# Altium schematic sheet ControlPoint.SchDoc
size 420 x 297 mm
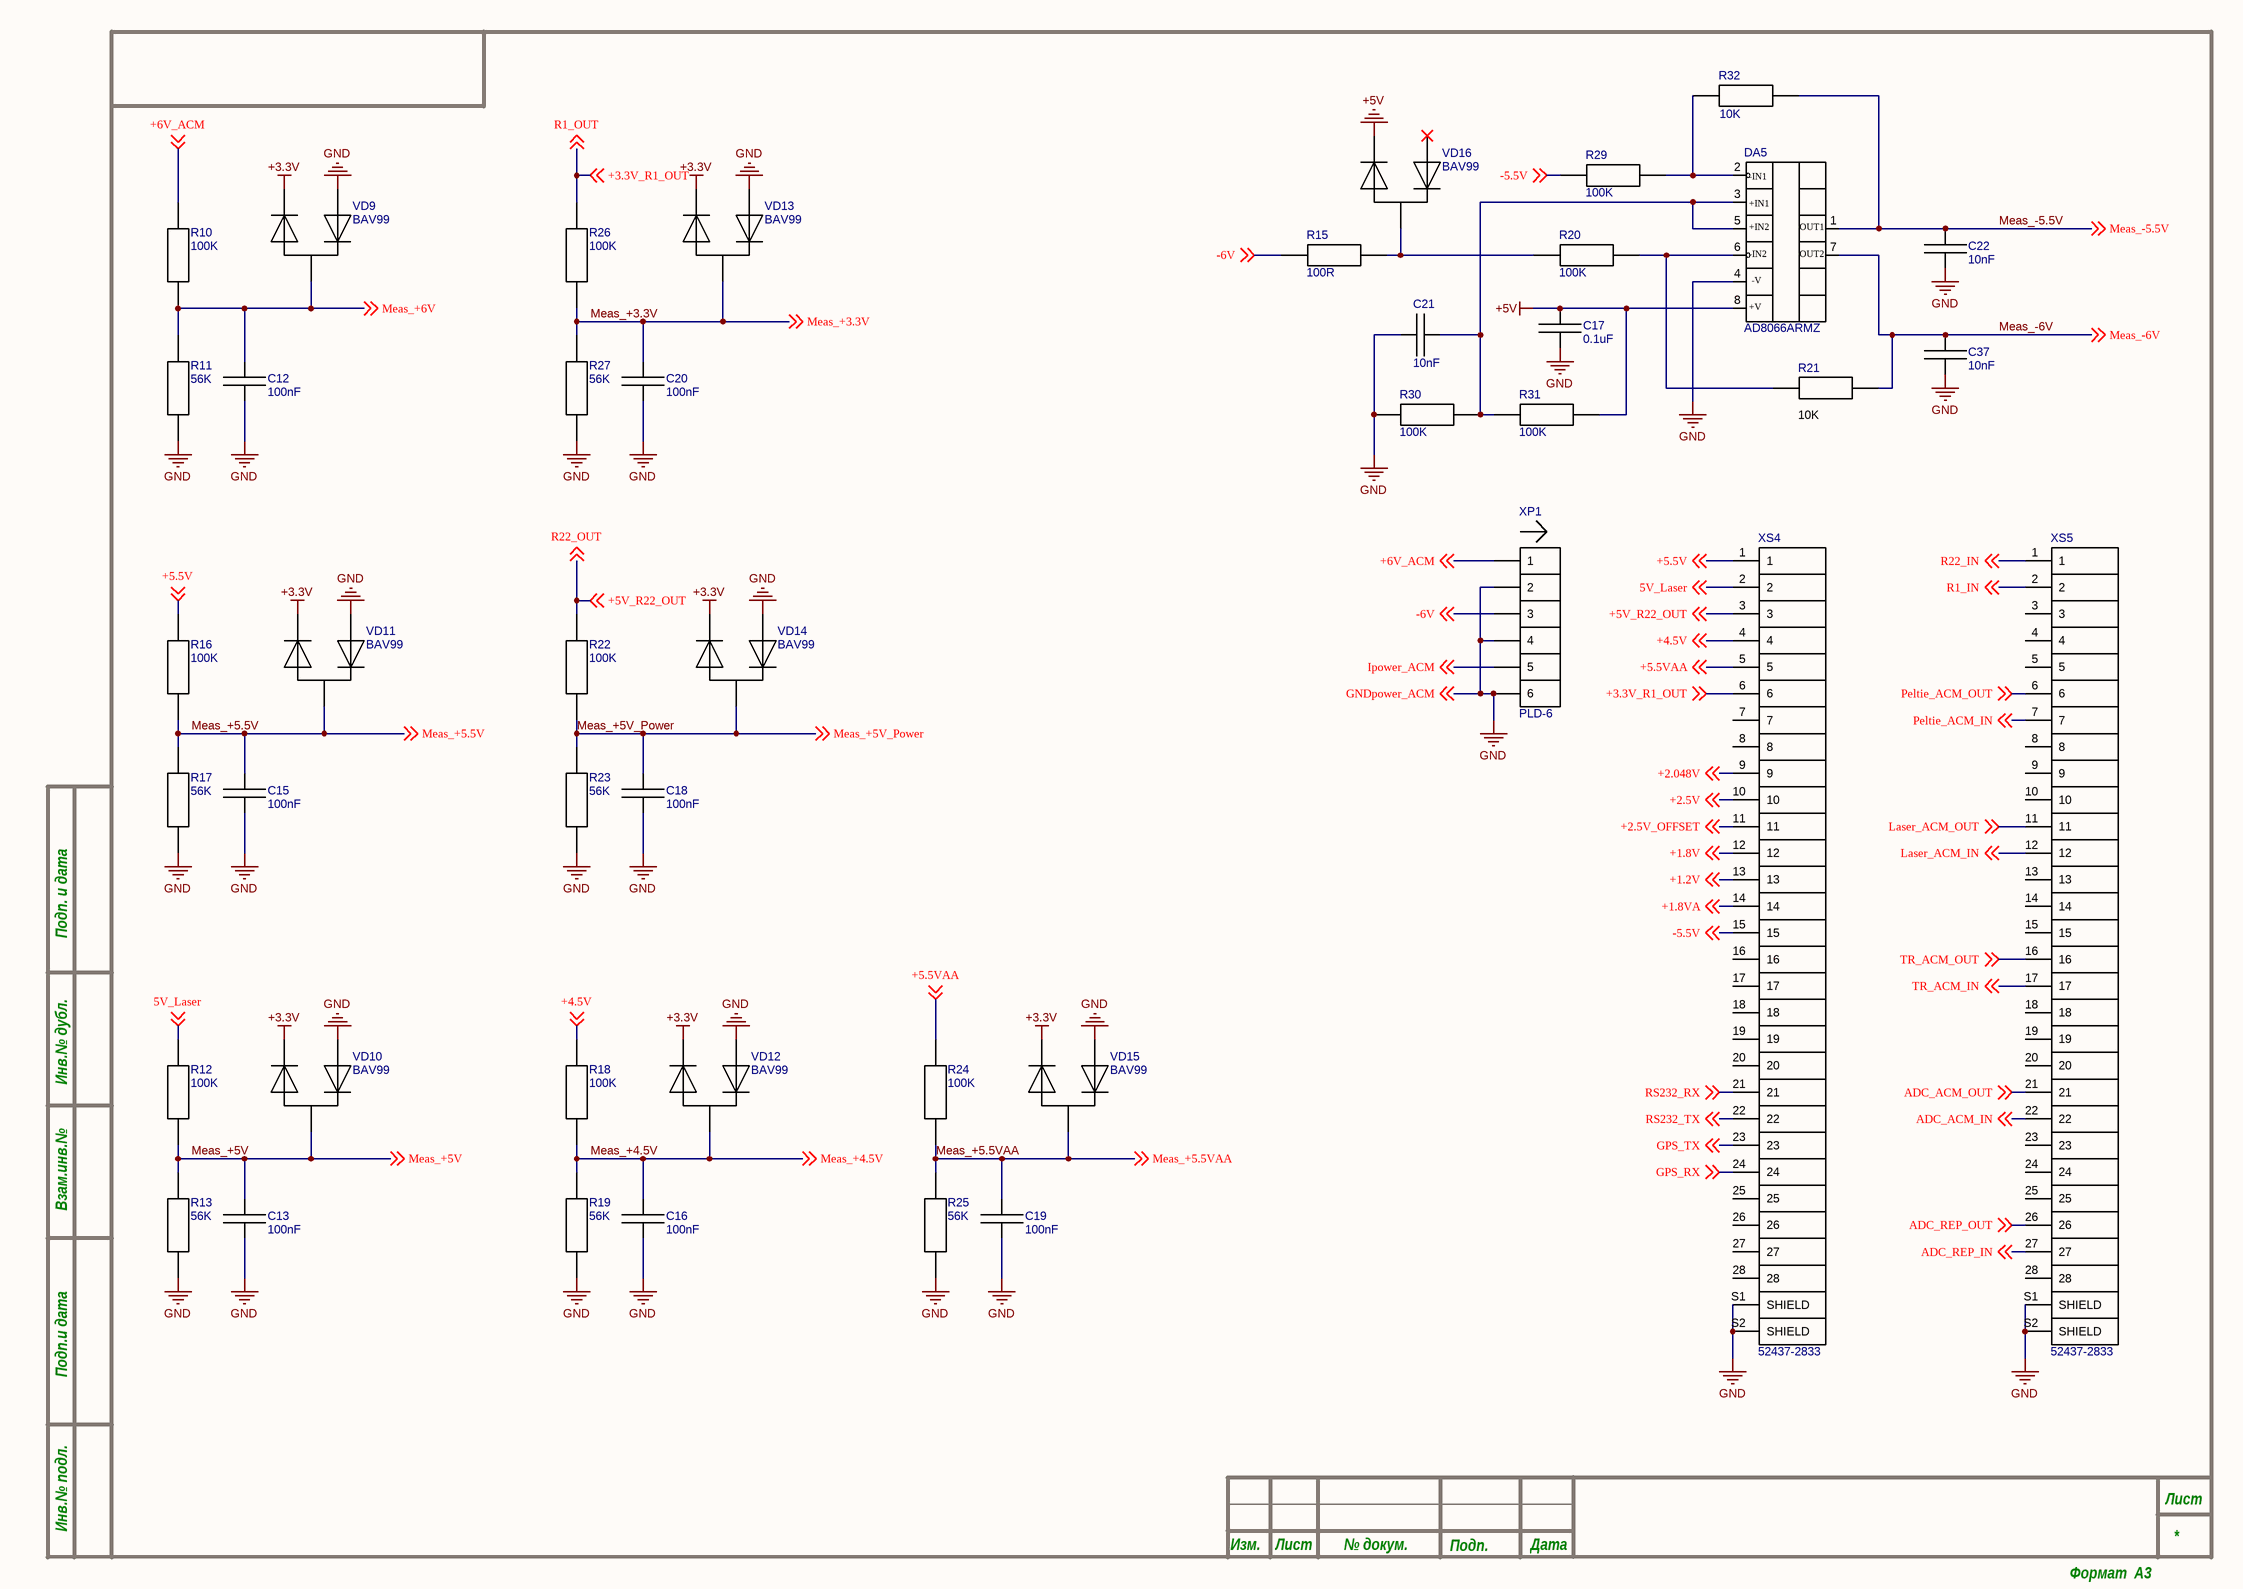
[diagram p0: ControlPoint.SchDoc]

## Parts
C12  100nF  [0402C]
C13  100nF  [0402C]
C15  100nF  [0402C]
C16  100nF  [0402C]
C17  0.1uF  [0603C]
C18  100nF  [0402C]
C19  100nF  [0402C]
C20  100nF  [0402C]
C21  10nF  [0402C]
C22  10nF  [0402C]
C37  10nF  [0402C]
DA5  AD8066ARMZ  [MSOP-8]
R10  100K  [R0402]
R11  56K  [R0402]
R12  100K  [R0402]
R13  56K  [R0402]
R15  100R  [R0402]
R16  100K  [R0402]
R17  56K  [R0402]
R18  100K  [R0402]
R19  56K  [R0402]
R20  100K  [R0402]
R21  10K  [R0402]
R22  100K  [R0402]
R23  56K  [R0402]
R24  100K  [R0402]
R25  56K  [R0402]
R26  100K  [R0402]
R27  56K  [R0402]
R29  100K  [R0402]
R30  100K  [R0402]
R31  100K  [R0402]
R32  10K  [R0402]
VD9  BAV99  [SOT-23-3]
VD10  BAV99  [SOT-23-3]
VD11  BAV99  [SOT-23-3]
VD12  BAV99  [SOT-23-3]
VD13  BAV99  [SOT-23-3]
VD14  BAV99  [SOT-23-3]
VD15  BAV99  [SOT-23-3]
VD16  BAV99  [SOT-23-3]
XP1  PLD-6  [PLD-6]
XS4  52437-2833  [MOLEX_52437-2833]
XS5  52437-2833  [MOLEX_52437-2833]

## Nets
+3.3V: VD9.2 VD10.2 VD11.2 VD12.2 VD13.2 VD14.2 VD15.2
+5V: C17.1 DA5.8(+VS) R31.2 VD16.2
GND: C12.1 C13.1 C15.1 C16.1 C17.2 C18.1 C19.1 C20.1 C21.1 C22.1 C37.1 DA5.4(-VS) R11.2 R13.2 R17.2 R19.2 R23.2 R25.2 R27.2 R30.1 VD9.1 VD10.1 VD11.1 VD12.1 VD13.1 VD14.1 VD15.1 XP1.2 XP1.4 XP1.6 XS4.S1(SHIELD) XS4.S2(SHIELD) XS5.S1(SHIELD) XS5.S2(SHIELD) ; off-sheet GNDpower_ACM  [also labelled GNDpower_ACM]
5V_Laser: R12.1 XS4.2 ; off-sheet 5V_Laser
+1.2V: XS4.13 ; off-sheet +1.2V
+1.8V: XS4.12 ; off-sheet +1.8V
+1.8VA: XS4.14 ; off-sheet +1.8VA
+2.5V: XS4.10 ; off-sheet +2.5V
+2.5V_OFFSET: XS4.11 ; off-sheet +2.5V_OFFSET
+2.048V: XS4.9 ; off-sheet +2.048V
+3.3V_R1_OUT: R26.1 XS4.6 ; off-sheet R1_OUT, off-sheet +3.3V_R1_OUT  [also labelled R1_OUT]
+4.5V: R18.1 XS4.4 ; off-sheet +4.5V
+5.5V: R16.1 XS4.1 ; off-sheet +5.5V
+5.5VAA: R24.1 XS4.5 ; off-sheet +5.5VAA
+5V_R22_OUT: R22.1 XS4.3 ; off-sheet R22_OUT, off-sheet +5V_R22_OUT  [also labelled R22_OUT]
+6V_ACM: R10.1 XP1.1 ; off-sheet +6V_ACM
-5.5V: R29.1 XS4.15 ; off-sheet -5.5V
-6V: R15.1 XP1.3 ; off-sheet -6V
ADC_ACM_IN: XS5.22 ; off-sheet ADC_ACM_IN
ADC_ACM_OUT: XS5.21 ; off-sheet ADC_ACM_OUT
ADC_REP_IN: XS5.27 ; off-sheet ADC_REP_IN
ADC_REP_OUT: XS5.26 ; off-sheet ADC_REP_OUT
GPS_RX: XS4.24 ; off-sheet GPS_RX
GPS_TX: XS4.23 ; off-sheet GPS_TX
Ipower_ACM: XP1.5 ; off-sheet Ipower_ACM
Laser_ACM_IN: XS5.12 ; off-sheet Laser_ACM_IN
Laser_ACM_OUT: XS5.11 ; off-sheet Laser_ACM_OUT
Meas_+3.3V: C20.2 R26.2 R27.1 VD13.3 ; off-sheet Meas_+3.3V
Meas_+4.5V: C16.2 R18.2 R19.1 VD12.3 ; off-sheet Meas_+4.5V
Meas_+5.5V: C15.2 R16.2 R17.1 VD11.3 ; off-sheet Meas_+5.5V
Meas_+5.5VAA: C19.2 R24.2 R25.1 VD15.3 ; off-sheet Meas_+5.5VAA
Meas_+5V: C13.2 R12.2 R13.1 VD10.3 ; off-sheet Meas_+5V
Meas_+5V_Power: C18.2 R22.2 R23.1 VD14.3 ; off-sheet Meas_+5V_Power
Meas_+6V: C12.2 R10.2 R11.1 VD9.3 ; off-sheet Meas_+6V
Meas_-5.5V: C22.2 DA5.1(VOUT) R32.2 ; off-sheet Meas_-5.5V
Meas_-6V: C37.2 DA5.7(VOUT2) R21.2 ; off-sheet Meas_-6V
Peltie_ACM_IN: XS5.7 ; off-sheet Peltie_ACM_IN
Peltie_ACM_OUT: XS5.6 ; off-sheet Peltie_ACM_OUT
R1_IN: XS5.2 ; off-sheet R1_IN
R22_IN: XS5.1 ; off-sheet R22_IN
RS232_RX: XS4.21 ; off-sheet RS232_RX
RS232_TX: XS4.22 ; off-sheet RS232_TX
TR_ACM_IN: XS5.17 ; off-sheet TR_ACM_IN
TR_ACM_OUT: XS5.16 ; off-sheet TR_ACM_OUT
NetC21_2: C21.2 DA5.3(+IN1) DA5.5(+IN2) R30.2 R31.1
NetDA5_2: DA5.2(-IN1) R29.2 R32.1
NetDA5_6: DA5.6(-IN2) R20.2 R21.1
NetR15_2: R15.2 R20.1 VD16.3

Not connected (* = marked no-connect by the designer): VD16 1*; XS4 7 8 16 17 18 19 20 25 26 27 28; XS5 3 4 5 8 9 10 13 14 15 18 19 20 23 24 25 28

## Notes on the sheet
- Подп. и дата
- Инв.№ дубл.
- Взам.инв.№
- Подп.и дата
- Инв.№ подл.
- Изм.
- Лист
- № докум.
- Подп.
- Дата
- Формат  A3
- (in symbol AD8066ARMZ) OUT1; OUT2; -V; +V

## Library data of the parts
C12 C13 C15 C16 C18-C20 = C0402-100nF 10% 50V: Part Number: SMD CAP CER 100nF ±10% 50V X5R 0402; Added_by: Rutel@Mail.ru; Solder_Amount: 2; Pkg: 0402; Created_at: 27/03/2020; MountType: SMD; Mount: MOUNT
C17 = C0603-0.1UF 10% 50V: C0603 0.1UF 10% 50V; Part Number: SMD CAP CER 0.1UF ±10% 50V X7R 0603; Added_by: anton@teslatec.ru; Solder_Amount: 2; Pkg: 0603; Created_at: 10/01/2023; MountType: SMD; Mount: MOUNT
C21 C22 C37 = C0402-10nF 10% 50V: Part Number: SMD CAP CER 10nF ±10% 50V X5R 0402; Added_by: Rutel@Mail.ru; Solder_Amount: 2; Pkg: 0402; Created_at: 27/03/2020; MountType: SMD; Mount: MOUNT
DA5 = AD8066ARMZ: High Performance, 145 MHz FastFET Op Amps; Added_by: irdolgopolowa@yandex.ru; Solder_Amount: 8; Created_at: 29/10/24; Mount: MOUNT; MountType: SMD; Pkg: MSOP-8; Part Number: AD8066ARMZ
R10 R12 R16 R18 R20 R22 R24 R26 R29-R31 = R0402-100K: Resistor SMD 100K 1% 0402; Part Number: SMD RES 100 KOHM 1% ±100ppm/°C 0402; Added_by: Rutel@teslatec.ru; Solder_Amount: 2; Pkg: 0402; Created_at: 21/04/2020; MountType: SMD; Mount: MOUNT
R11 R13 R17 R19 R23 R25 R27 = R0402-56K: Resistor SMD 56K 1% 0402; Part Number: SMD RES 56K KOHM 1% ±100ppm/°C 0402; Added_by: ridel_av@teslatec.ru; Solder_Amount: 2; Pkg: 0402; Created_at: 15/12/2021; MountType: SMD; Mount: MOUNT
R15 = R0402-100R: Resistor SMD 100R 1% 0402; Part Number: SMD RES 100 OHM 1% ±100ppm/°C 0402; Added_by: irdolgopolowa@yandex.ru; Solder_Amount: 2; Pkg: 0402; Created_at: 29/10/24; MountType: SMD; Mount: MOUNT
R21 R32 = R0402-10K: Resistor SMD 10K 1% 0402; Part Number: SMD RES 10 KOHM 1% ±100ppm/°C 0402; Added_by: Rutel@teslatec.ru; Solder_Amount: 2; Pkg: 0402; Created_at: 21/04/2020; MountType: SMD; Mount: MOUNT
VD9-VD16 = BAV99: BAV99, UMW, 70В, 200мА; Added_by: andrew@teslatec.ru; Solder_Amount: 3; Created_at: 29/06/2020; Mount: MOUNT; MountType: SMD; Pkg: SOT-23-3; Part Number: BAV99
XP1 = PLD-6: Pin Header Pitch 2.54mm; Part Number: PLD-6 (DS1021-2x3); Pkg: PLD-6 2.54mm; Solder_Amount: 6; Added_by: ponomarev_ke@teslatec.ru; MountType: THM; Mount: MOUNT; Mating Part: *; Mating Terminals: *; Cable/Wire: *; Created_at: 21/05/2019
XS4 XS5 = 52437-2833: 28 Position FFC, FPC Connector Contacts, Bottom 0.020 _0.50mm_ Surface Mount, Right Angle; Part Number: 52437-2833 (MOLEX); Mating Part: FFCA 28pin, 0.5mm pitch, AVM 20624 80C 60V VW-1; Solder_Amount: 30; Added_by: ridel_av@teslatec.ru; Mount: MOUNT; MountType: SMD; Pkg: 52437-2833